# Altium schematic sheet CLP_v1.2_Sch1.SchDoc
size A3
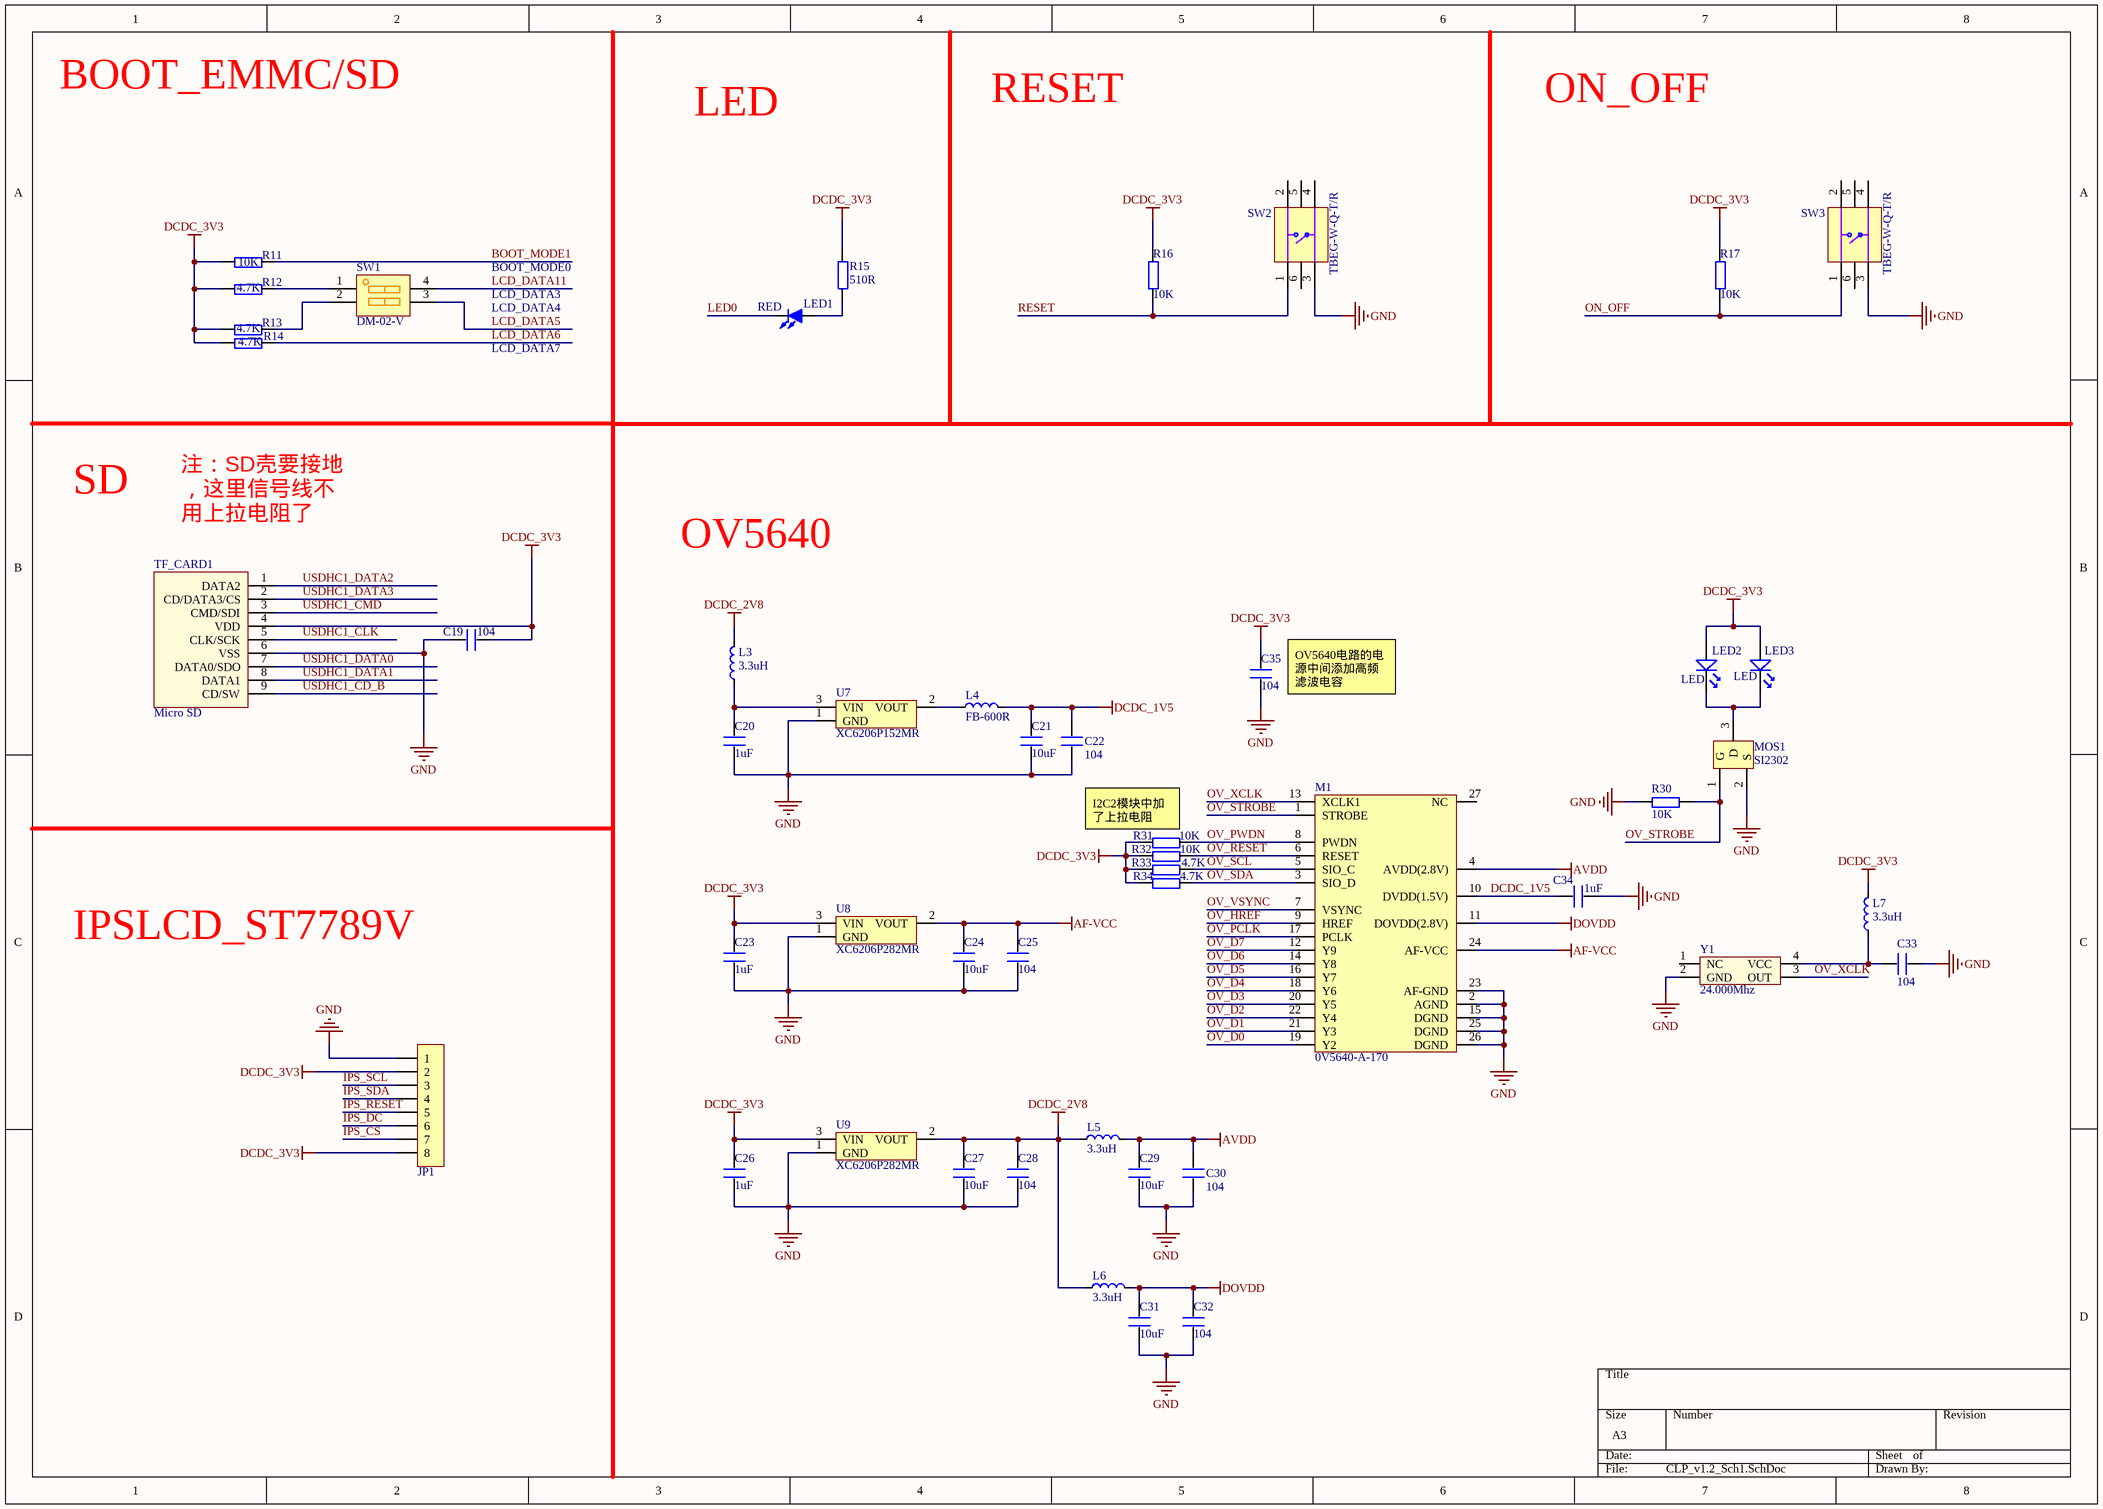
[diagram p0: CLP_v1.2_Sch1.SchDoc]

## Parts
C19  104  [C 0603]
C20  1uF  [C 0603]
C21  10uF  [C 0603]
C22  104  [C 0603]
C23  1uF  [C 0603]
C24  10uF  [C 0603]
C25  104  [C 0603]
C26  1uF  [C 0603]
C27  10uF  [C 0603]
C28  104  [C 0603]
C29  10uF  [C 0603]
C30  104  [C 0603]
C31  10uF  [C 0603]
C32  104  [C 0603]
C33  104  [C 0603]
C34  1uF  [C 0603]
C35  104  [C 0603]
JP1  HDR-1X8  [HDR-1X8_M]  (value not drawn)
L3  3.3uH  [L 0603]
L4  FB-600R  [L 0603]
L5  3.3uH  [L 0603]
L6  3.3uH  [L 0603]
L7  3.3uH  [L 0603]
LED1  RED  [LED 0805R]
LED2  LED  [SMDLED-3528]
LED3  LED  [SMDLED-3528]
M1  0V5640-A-170  [OV5640]
MOS1  SI2302  [SO-G3/C2.5]
R11  10K  [R 0603]
R12  4.7K  [R 0603]
R13  4.7K  [R 0603]
R14  4.7K  [R 0603]
R15  510R  [R 0603]
R16  10K  [R 0603]
R17  10K  [R 0603]
R30  10K  [R 0603]
R31  10K  [R 0603]
R32  10K  [R 0603]
R33  4.7K  [R 0603]
R34  4.7K  [R 0603]
SW1  DM-02-V  [SMD_KEY]
SW2  TBEG-W-Q-T/R  [SW]
SW3  TBEG-W-Q-T/R  [SW]
TF_CARD1  Micro SD  [Micro SD]
U7  XC6206P152MR  [SOT-23]
U8  XC6206P282MR  [SOT-23]
U9  XC6206P282MR  [SOT-23]
Y1  24.000Mhz  [XTAL3225]

## Nets
AF-VCC: C24.2 C25.2 M1.24(AF-VCC) U8.2(VOUT)
AVDD: C29.2 C30.2 L5.2 M1.4(AVDD(2.8V))
DCDC_1V5: C21.2 C22.2 C34.1 L4.2 M1.10(DVDD(1.5V))
DCDC_2V8: C27.2 C28.2 L3.2 L5.1 L6.1 U9.2(VOUT)
DCDC_3V3: C19.2 C23.2 C26.2 C35.2 JP1.2 JP1.8 L7.2 LED2.1 LED3.1 R11.1 R12.1 R13.1 R14.1 R15.2 R16.2 R17.2 R31.1 R32.1 R33.1 R34.1 TF_CARD1.4(VDD) U8.3(VIN) U9.3(VIN)
DOVDD: C31.2 C32.2 L6.2 M1.11(DOVDD(2.8V))
GND: C19.1 C20.1 C21.1 C22.1 C23.1 C24.1 C25.1 C26.1 C27.1 C28.1 C29.1 C30.1 C31.1 C32.1 C33.2 C34.2 C35.1 JP1.1 M1.2(AGND) M1.15(DGND) M1.23(AF-GND) M1.25(DGND) M1.26(DGND) MOS1.2(S) R30.1 SW2.3 SW3.3 TF_CARD1.6(VSS) U7.1(GND) U8.1(GND) U9.1(GND) Y1.2(GND)
BOOT_MODE1: R11.2
IPS_CS: JP1.7
IPS_DC: JP1.6
IPS_RESET: JP1.5
IPS_SCL: JP1.3
IPS_SDA: JP1.4
LCD_DATA5: SW1.3
LCD_DATA6: R14.2
LCD_DATA11: SW1.4
LED0: LED1.2(K)
ON_OFF: R17.1 SW3.1
OV_D0: M1.19(Y2)
OV_D1: M1.21(Y3)
OV_D2: M1.22(Y4)
OV_D3: M1.20(Y5)
OV_D4: M1.18(Y6)
OV_D5: M1.16(Y7)
OV_D6: M1.14(Y8)
OV_D7: M1.12(Y9)
OV_HREF: M1.9(HREF)
OV_PCLK: M1.17(PCLK)
OV_PWDN: M1.8(PWDN) R31.2
OV_RESET: M1.6(RESET) R32.2
OV_SCL: M1.5(SIO_C) R33.2
OV_SDA: M1.3(SIO_D) R34.2
OV_STROBE: M1.1(STROBE) MOS1.1(G) R30.2
OV_VSYNC: M1.7(VSYNC)
OV_XCLK: M1.13(XCLK1) Y1.3(OUT)
RESET: R16.1 SW2.1
USDHC1_CD_B: TF_CARD1.9(CD/SW)
USDHC1_CLK: TF_CARD1.5(CLK/SCK)
USDHC1_CMD: TF_CARD1.3(CMD/SDI)
USDHC1_DATA0: TF_CARD1.7(DATA0/SDO)
USDHC1_DATA1: TF_CARD1.8(DATA1)
USDHC1_DATA2: TF_CARD1.1(DATA2)
USDHC1_DATA3: TF_CARD1.2(CD/DATA3/CS)
NetC20_2: C20.2 L3.1 U7.3(VIN)
NetC33_1: C33.1 L7.1 Y1.4(VCC)
NetL4_1: L4.1 U7.2(VOUT)
NetLED1_1: LED1.1(A) R15.1
NetLED2_2: LED2.2 LED3.2 MOS1.3(D)
NetR12_2: R12.2 SW1.1
NetR13_2: R13.2 SW1.2

Not connected (* = marked no-connect by the designer): M1 27(NC); SW2 2 4 5 6; SW3 2 4 5 6; Y1 1(NC)

## Notes on the sheet
- BOOT_EMMC/SD
- RESET
- ON_OFF
- LED
- LCD_DATA3
- LCD_DATA4
- BOOT_MODE0
- LCD_DATA7
- SD
- 注：SD壳要接地，这里信号线不用上拉电阻了
- OV5640
- (near C35) OV5640电路的电源中间添加高频滤波电容
- (near R31) I2C2模块中加了上拉电阻
- IPSLCD_ST7789V

## Library data of the parts
C19-C35 = C
JP1 = Header 8: 8P接插件; 版权归属: 黎明电子style; BOM名称: 8P接插件; 学习资源: https://lmdzstyle.taobao.com/
L3-L7 = L: 小功率贴片电感磁珠; 版权归属: 源创客; BOM名称: 小功率贴片电感; 学习资源: www.ooocke.com
LED1 = LED-SMD: 贴片LED; 版权归属: 源创客; BOM名称: 贴片LED; 学习资源: www.ooocke.com
M1 = OV5640-A-170: OV5640-A-170,AF,FPC
MOS1 = MOS-N: AP2306
R11-R17 R30-R34 = R
SW1 = SMD_KEY: boot && led key
SW2 SW3 = SW: key
TF_CARD1 = Micro SD: Micro SD卡; 版权归属: 源创客; BOM名称: Micro SD卡; 学习资源: www.ooocke.com
U7-U9 = XC6206: LDO,SOT23,1.2~5.0V
Y1 = XTAL_S: 有源晶振